# EAGLE schematic SOC_mcu_v2 (EAGLE 6.2)

## Sheet 1 of 4: Alimentación
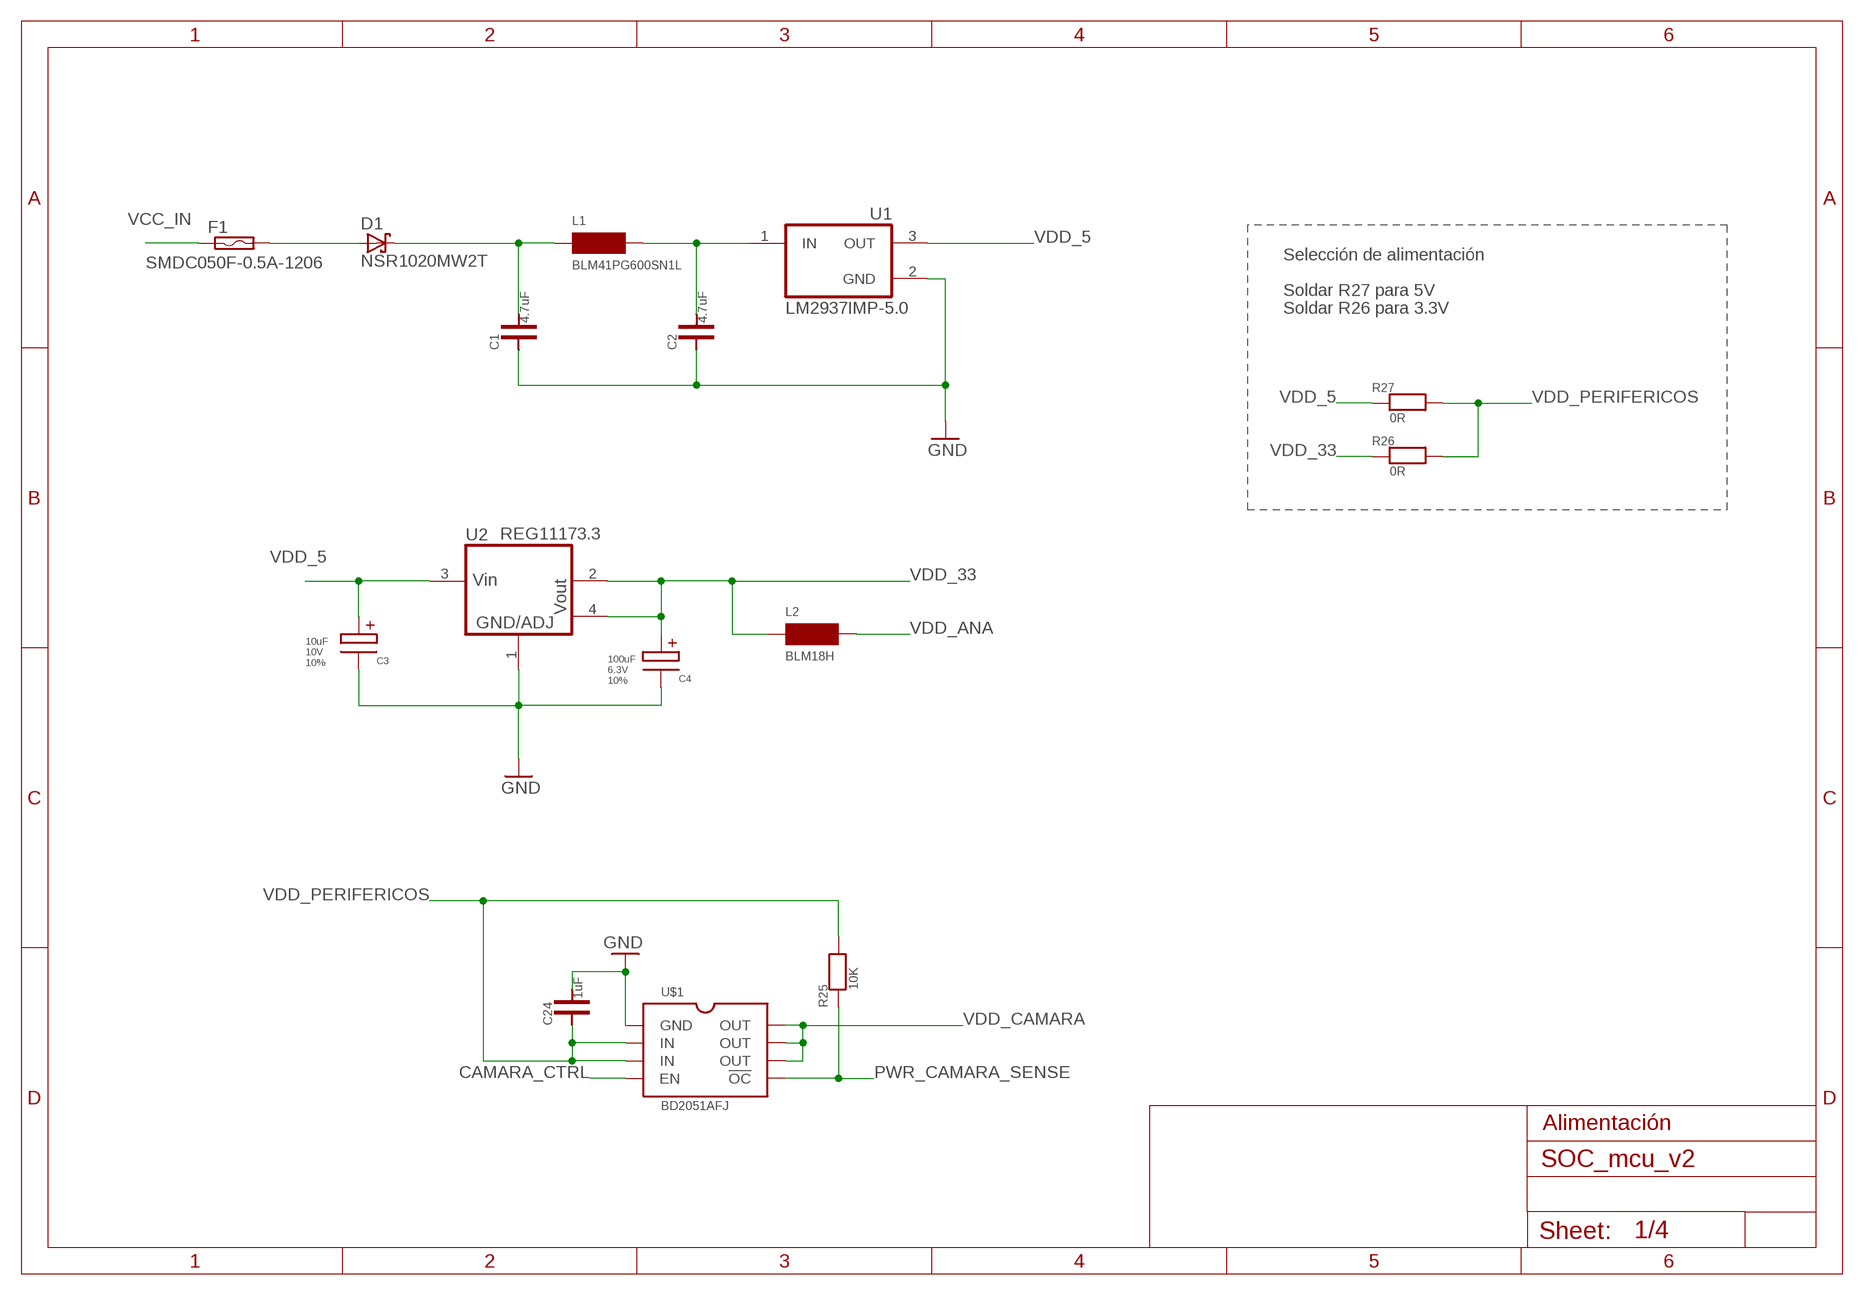
[diagram p0: schematic, sheet 1]

### Parts
C1  4.7uF  C_TF-4U7-16V-0805  [C0805]
C2  4.7uF  C_TF-4U7-16V-0805  [C0805]
C3  10uF  C293D10U-10V-10%-B  [3528-21]
C4  100uF  C293D100U-6V3-10%-B  [3528-21]
C24  1uF  C_TF-1U-6.3V-0402  [C0402]
D1  NSR1020MW2T  [SOD323]
F1  SMDC050F-0.5A-1206  [1206]
L1  BLM41PG600SN1L  [1806]
L2  BLM18H  [0603]
R25  10K  R_TF-10K-0.125W-1%-0402  [R0402]
R26  0R  R_TF-0R-0.0625W-0.05%-0402  [R0402]
R27  0R  R_TF-0R-0.0625W-0.05%-0402  [R0402]
U1  LM2937IMP-5.0  [SOT223]
U2  REG11173.3  [SOT223]
U$1  BD2051AFJ  [SO08]

### Nets
CAMARA_CTRL: U$1.4(EN) ; also sheet 2
GND: C1.1 C2.1 C3.NEG C4.NEG C24.2 U1.2(GND) U2.1(GND) U$1.1(GND) ; also sheet 2,3,4
N$1: C2.2 L1.P$2 U1.1(IN)
N$2: C1.2 D1.C L1.P$1
N$3: D1.A F1.2
PWR_CAMARA_SENSE: R25.1 U$1.5(!OC) ; also sheet 2
VCC_IN: F1.1 ; also sheet 4
VDD_5: C3.POS R27.1 U1.3(OUT) U2.3(VIN)
VDD_33: C4.POS L2.1 R26.1 U2.2(VOUT) U2.4(VO2) ; also sheet 2,3,4
VDD_ANA: L2.2 ; also sheet 2
VDD_CAMARA: U$1.6(OUT) U$1.7(OUT) U$1.8(OUT) ; also sheet 4
VDD_PERIFERICOS: C24.1 R25.2 R26.2 R27.2 U$1.2(IN) U$1.3(IN) ; also sheet 3

### Notes on the sheet
- Selección de alimentación
- Soldar R27 para 5V
- Soldar R26 para 3.3V
- Alimentación

## Sheet 2 of 4: Microprocesador
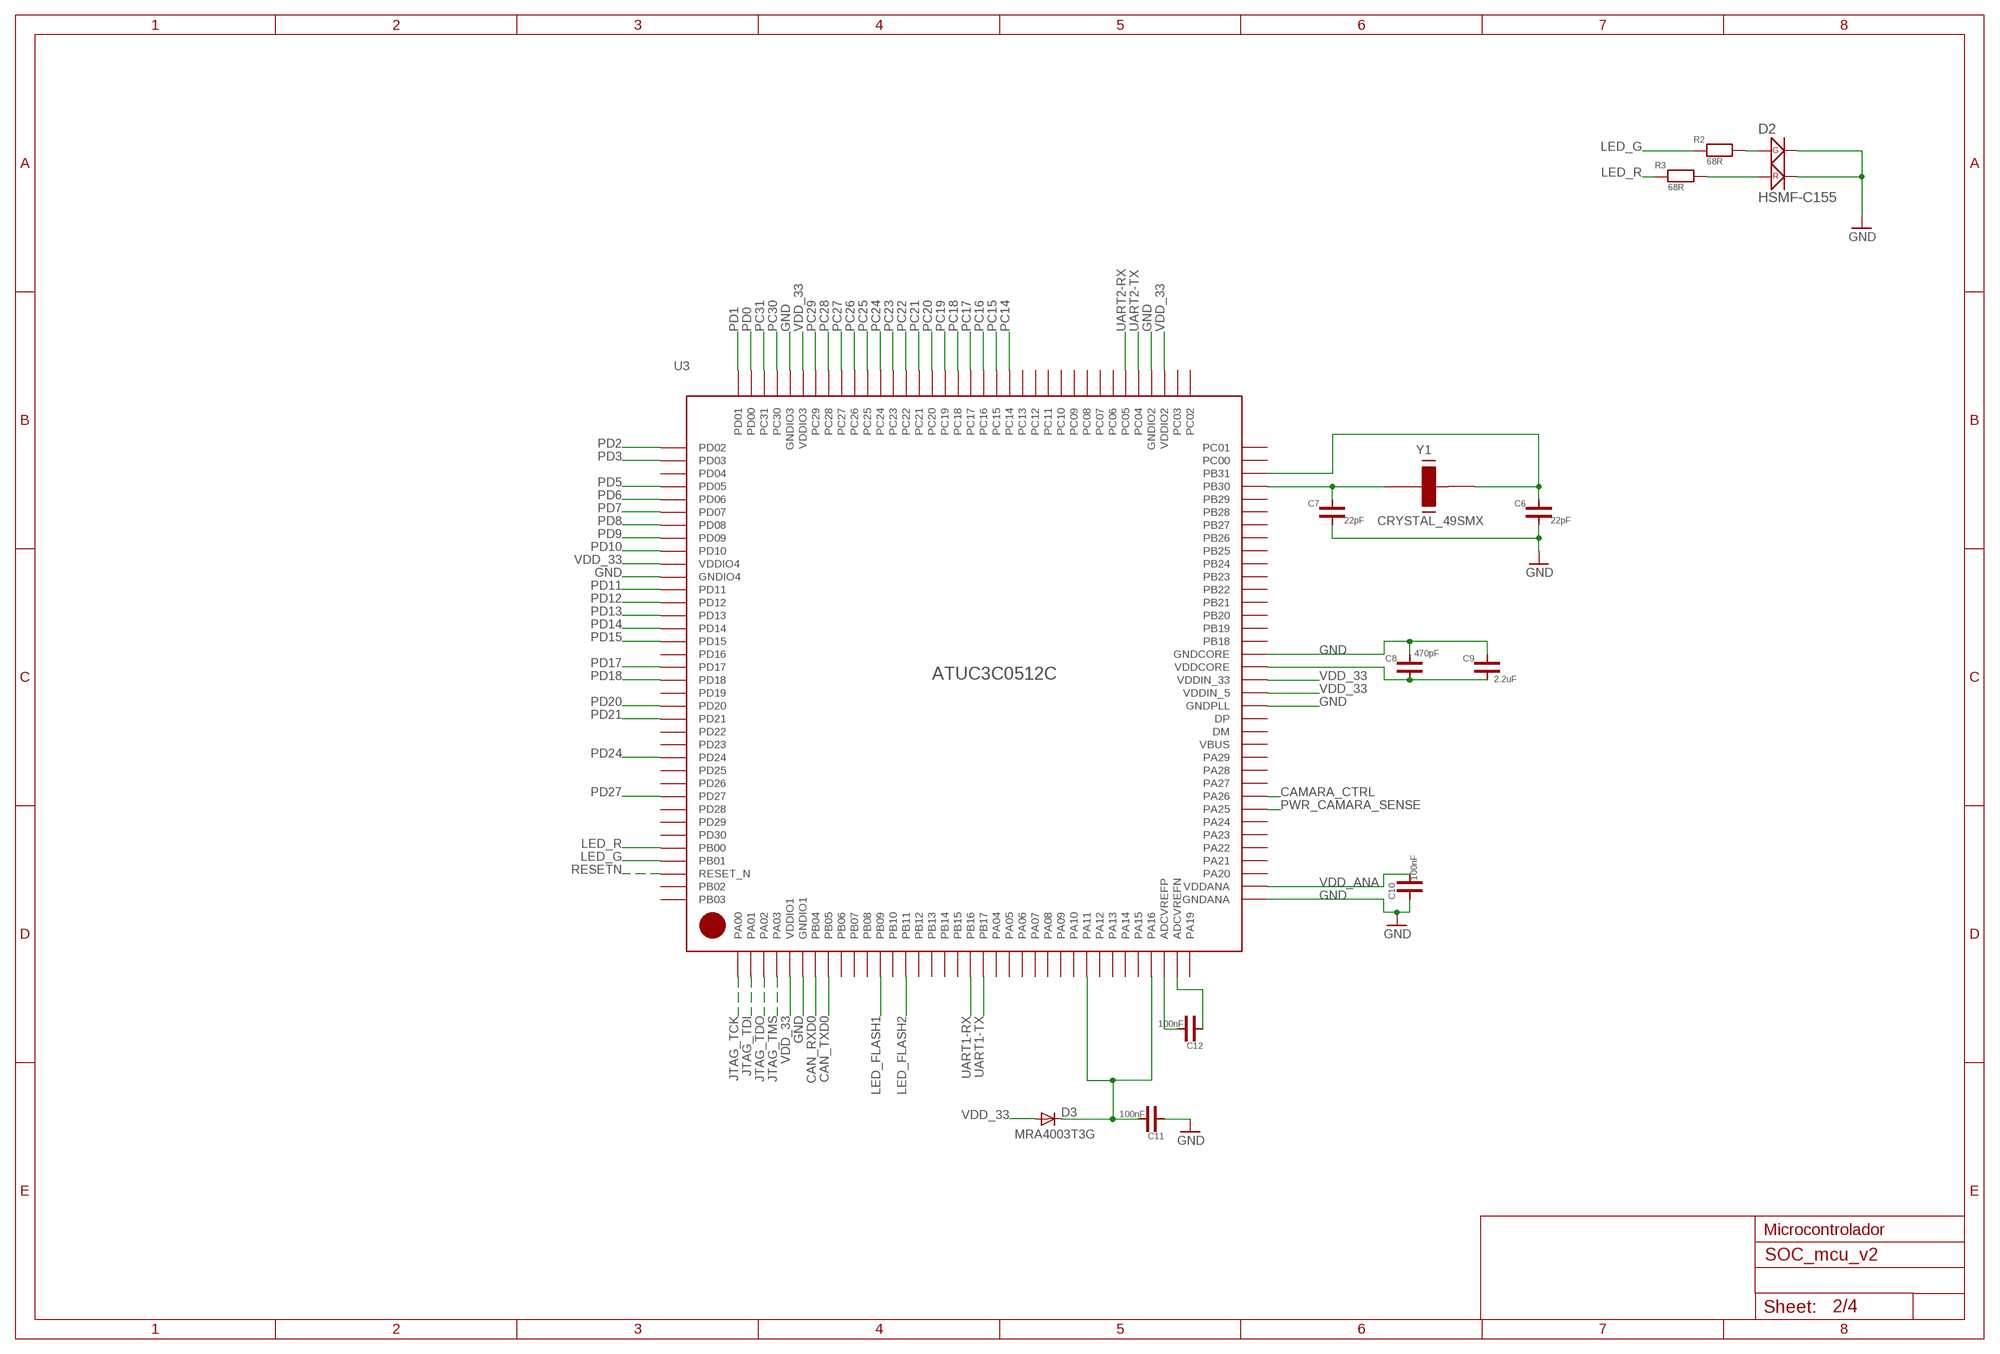
[diagram p1: schematic, sheet 2]

### Parts
C6  22pF  C_TF-22P-50V-0402  [C0402]
C7  22pF  C_TF-22P-50V-0402  [C0402]
C8  470pF  C_TF-470P-50V-0402  [C0402]
C9  2.2uF  C_TF-2U2-16V-0603  [C0603]
C10  100nF  C_TF-100N-25V-0402  [C0402]
C11  100nF  C_TF-100N-25V-0402  [C0402]
C12  100nF  C_TF-100N-25V-0402  [C0402]
D2  HSMF-C155  [HSMF-C]
D3  MRA4003T3G  [SMA]
R2  68R  R_TF-68R-0.063W-5%-0402  [R0402]
R3  68R  R_TF-68R-0.063W-5%-0402  [R0402]
U3  ATUC3C0512C  [TQFP144]
Y1  CRYSTAL_49SMX  [HC49UP]

### Nets
CAMARA_CTRL: U3.45(PA26) ; also sheet 1
CAN_RXD0: U3.7(PB04) ; also sheet 3
CAN_TXD0: U3.8(PB05) ; also sheet 3
GND: C6.1 C7.1 C8.2 C9.2 C10.1 C11.1 D2.2 D2.4 U3.6(GNDIO1) U3.37(GNDANA) U3.52(GNDPLL) U3.56(GNDCORE) U3.76(GNDIO2) U3.104(GNDIO3) U3.119(GNDIO4) ; also sheet 1,3,4
JTAG_TCK: U3.1(PA00) ; also sheet 4
JTAG_TDI: U3.2(PA01) ; also sheet 4
JTAG_TDO: U3.3(PA02) ; also sheet 4
JTAG_TMS: U3.4(PA03) ; also sheet 4
LED_FLASH1: U3.12(PB09) ; also sheet 4
LED_FLASH2: U3.14(PB11) ; also sheet 4
LED_G: R2.1 U3.141(PB01)
LED_R: R3.1 U3.140(PB00)
N$4: C6.2 U3.70(PB31) Y1.2
N$5: C7.2 U3.69(PB30) Y1.1
N$6: C8.1 C9.1 U3.55(VDDCORE)
N$7: D2.1 R2.2
N$8: D2.3 R3.2
N$10: C11.2 D3.C U3.28(PA11) U3.33(PA16)
N$11: C12.2 U3.34(ADCVREFP)
N$12: C12.1 U3.35(ADCVREFN)
PC14: U3.87(PC14) ; also sheet 3
PC15: U3.88(PC15) ; also sheet 3
PC16: U3.89(PC16) ; also sheet 3
PC17: U3.90(PC17) ; also sheet 3
PC18: U3.91(PC18) ; also sheet 3
PC19: U3.92(PC19) ; also sheet 3
PC20: U3.93(PC20) ; also sheet 3
PC21: U3.94(PC21) ; also sheet 3
PC22: U3.95(PC22) ; also sheet 3
PC23: U3.96(PC23) ; also sheet 3
PC24: U3.97(PC24) ; also sheet 3
PC25: U3.98(PC25) ; also sheet 3
PC26: U3.99(PC26) ; also sheet 3
PC27: U3.100(PC27) ; also sheet 3
PC28: U3.101(PC28) ; also sheet 3
PC29: U3.102(PC29) ; also sheet 3
PC30: U3.105(PC30) ; also sheet 3
PC31: U3.106(PC31) ; also sheet 3
PD0: U3.107(PD00) ; also sheet 3
PD1: U3.108(PD01) ; also sheet 3
PD2: U3.109(PD02) ; also sheet 3
PD3: U3.110(PD03) ; also sheet 3
PD5: U3.112(PD05) ; also sheet 3
PD6: U3.113(PD06) ; also sheet 3
PD7: U3.114(PD07) ; also sheet 3
PD8: U3.115(PD08) ; also sheet 3
PD9: U3.116(PD09) ; also sheet 3
PD10: U3.117(PD10) ; also sheet 3
PD11: U3.120(PD11) ; also sheet 3
PD12: U3.121(PD12) ; also sheet 3
PD13: U3.122(PD13) ; also sheet 3
PD14: U3.123(PD14) ; also sheet 3
PD15: U3.124(PD15) ; also sheet 3
PD17: U3.126(PD17) ; also sheet 3
PD18: U3.127(PD18) ; also sheet 3
PD20: U3.129(PD20) ; also sheet 3
PD21: U3.130(PD21) ; also sheet 3
PD24: U3.133(PD24) ; also sheet 3
PD27: U3.136(PD27) ; also sheet 3
PWR_CAMARA_SENSE: U3.44(PA25) ; also sheet 1
RESETN: U3.142(RESET_N) ; also sheet 4
UART1-RX: U3.19(PB16) ; also sheet 3
UART1-TX: U3.20(PB17) ; also sheet 3
UART2-RX: U3.78(PC05) ; also sheet 3
UART2-TX: U3.77(PC04) ; also sheet 3
VDD_33: D3.A U3.5(VDDIO1) U3.53(VDDIN_5) U3.54(VDDIN_33) U3.75(VDDIO2) U3.103(VDDIO3) U3.118(VDDIO4) ; also sheet 1,3,4
VDD_ANA: C10.2 U3.38(VDDANA) ; also sheet 1
Unconnected: U3.9(PB06) U3.10(PB07) U3.11(PB08) U3.13(PB10) U3.15(PB12) U3.16(PB13) U3.17(PB14) U3.18(PB15) U3.21(PA04) U3.22(PA05) U3.23(PA06) U3.24(PA07) U3.25(PA08) U3.26(PA09) U3.27(PA10) U3.29(PA12) U3.30(PA13) U3.31(PA14) U3.32(PA15) U3.36(PA19) U3.39(PA20) U3.40(PA21) U3.41(PA22) U3.42(PA23) U3.43(PA24) U3.46(PA27) U3.47(PA28) U3.48(PA29) U3.49(VBUS) U3.50(DM) U3.51(DP) U3.57(PB18) U3.58(PB19) U3.59(PB20) U3.60(PB21) U3.61(PB22) U3.62(PB23) U3.63(PB24) U3.64(PB25) U3.65(PB26) U3.66(PB27) U3.67(PB28) U3.68(PB29) U3.71(PC00) U3.72(PC01) U3.73(PC02) U3.74(PC03) U3.79(PC06) U3.80(PC07) U3.81(PC08) U3.82(PC09) U3.83(PC10) U3.84(PC11) U3.85(PC12) U3.86(PC13) U3.111(PD04) U3.125(PD16) U3.128(PD19) U3.131(PD22) U3.132(PD23) U3.134(PD25) U3.135(PD26) U3.137(PD28) U3.138(PD29) U3.139(PD30) U3.143(PB02) U3.144(PB03)

### Notes on the sheet
- Microcontrolador

## Sheet 3 of 4: Perifericos
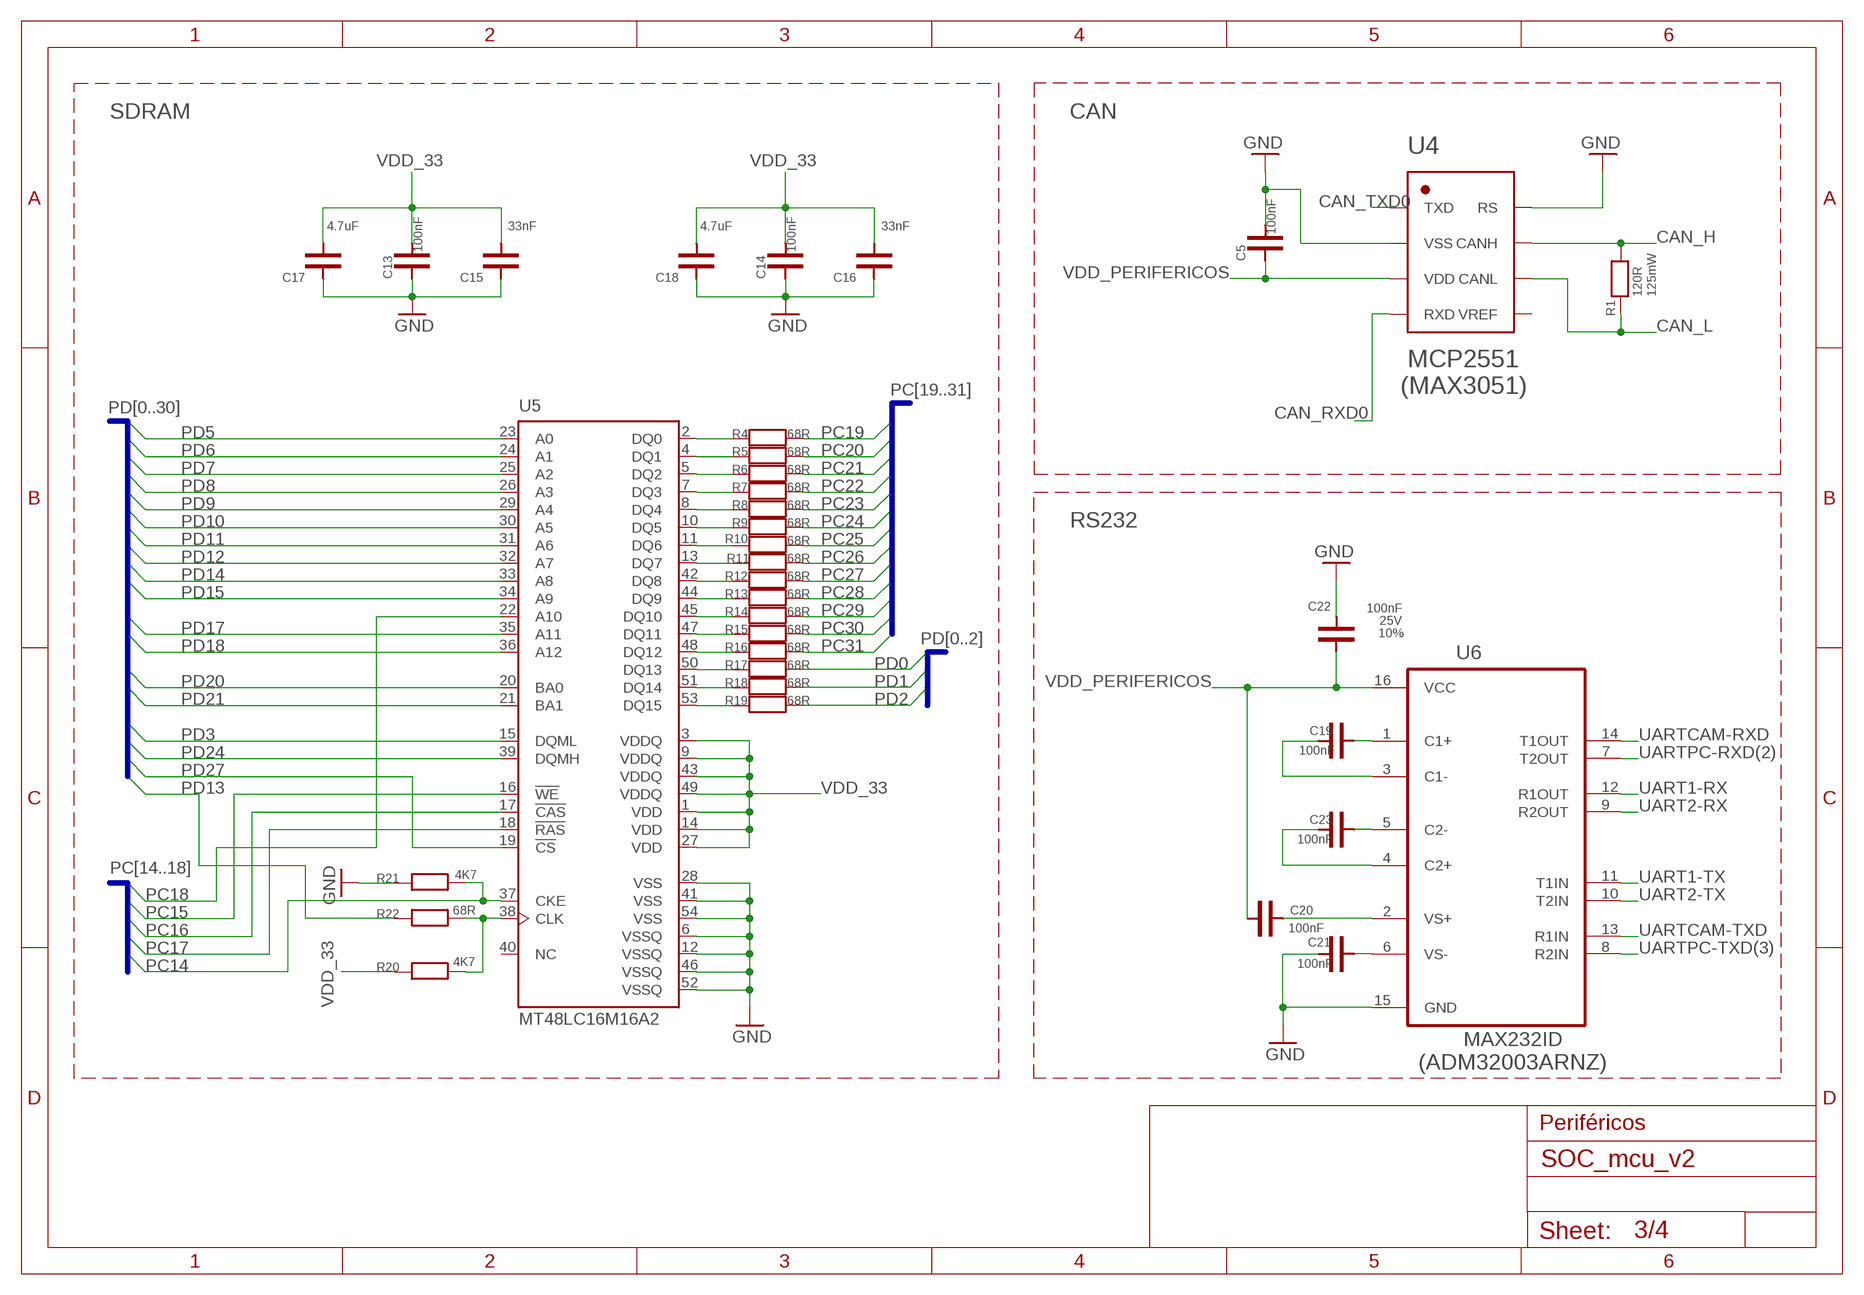
[diagram p2: schematic, sheet 3]

### Parts
C5  100nF  C_TF-100N-25V-0402  [C0402]
C13  100nF  C_TF-100N-25V-0402  [C0402]
C14  100nF  C_TF-100N-25V-0402  [C0402]
C15  33nF  C_TF-33N-25V-0402  [C0402]
C16  33nF  C_TF-33N-25V-0402  [C0402]
C17  4.7uF  C_TF-4U7-16V-0805  [C0805]
C18  4.7uF  C_TF-4U7-16V-0805  [C0805]
C19  100nF  C_TF-100N-25V-0402  [C0402]
C20  100nF  C_TF-100N-25V-0402  [C0402]
C21  100nF  C_TF-100N-25V-0402  [C0402]
C22  100nF  C_TF-100N-25V-0402  [C0402]
C23  100nF  C_TF-100N-25V-0402  [C0402]
R1  120R  R_TF-120R-0.125W-1%-0402  [R0402]
R4  68R  R_TF-68R-0.063W-5%-0402  [R0402]
R5  68R  R_TF-68R-0.063W-5%-0402  [R0402]
R6  68R  R_TF-68R-0.063W-5%-0402  [R0402]
R7  68R  R_TF-68R-0.063W-5%-0402  [R0402]
R8  68R  R_TF-68R-0.063W-5%-0402  [R0402]
R9  68R  R_TF-68R-0.063W-5%-0402  [R0402]
R10  68R  R_TF-68R-0.063W-5%-0402  [R0402]
R11  68R  R_TF-68R-0.063W-5%-0402  [R0402]
R12  68R  R_TF-68R-0.063W-5%-0402  [R0402]
R13  68R  R_TF-68R-0.063W-5%-0402  [R0402]
R14  68R  R_TF-68R-0.063W-5%-0402  [R0402]
R15  68R  R_TF-68R-0.063W-5%-0402  [R0402]
R16  68R  R_TF-68R-0.063W-5%-0402  [R0402]
R17  68R  R_TF-68R-0.063W-5%-0402  [R0402]
R18  68R  R_TF-68R-0.063W-5%-0402  [R0402]
R19  68R  R_TF-68R-0.063W-5%-0402  [R0402]
R20  4K7  R_TF-4K7-0.125W-1%-0402  [R0402]
R21  4K7  R_TF-4K7-0.125W-1%-0402  [R0402]
R22  68R  R_TF-68R-0.063W-5%-0402  [R0402]
U4  MCP2551  [SO08]
U5  MT48LC16M16A2  [TSOP54-400]
U6  MAX232ID  [SOIC127P600X175-16N]

### Nets
CAN_H: R1.2 U4.7(CANH) ; also sheet 4
CAN_L: R1.1 U4.6(CANL) ; also sheet 4
CAN_RXD0: U4.4(RXD) ; also sheet 2
CAN_TXD0: U4.1(TXD) ; also sheet 2
GND: C5.2 C13.1 C14.1 C15.1 C16.1 C17.1 C18.1 C21.1 C22.2 R21.1 U4.2(VSS) U4.8(RS) U5.6(VSSQ) U5.12(VSSQ) U5.28(VSS) U5.41(VSS) U5.46(VSSQ) U5.52(VSSQ) U5.54(VSS) U6.15(GND) ; also sheet 1,2,4
N$9: R4.1 U5.2(DQ0)
N$13: R5.1 U5.4(DQ1)
N$14: R6.1 U5.5(DQ2)
N$15: R7.1 U5.7(DQ3)
N$16: R8.1 U5.8(DQ4)
N$17: R9.1 U5.10(DQ5)
N$18: C19.2 U6.1(C1+)
N$19: R10.1 U5.11(DQ6)
N$20: R11.1 U5.13(DQ7)
N$21: R12.1 U5.42(DQ8)
N$22: R13.1 U5.44(DQ9)
N$23: R14.1 U5.45(DQ10)
N$24: R15.1 U5.47(DQ11)
N$25: R16.1 U5.48(DQ12)
N$26: R17.1 U5.50(DQ13)
N$27: R18.1 U5.51(DQ14)
N$28: R19.1 U5.53(DQ15)
N$30: R20.2 R22.2 U5.38(CLK)
N$32: C23.2 U6.5(C2-)
N$33: C19.1 U6.3(C1-)
N$34: C20.2 U6.2(VS+)
N$35: C23.1 U6.4(C2+)
N$37: C21.2 U6.6(VS-)
PC14: R21.2 U5.37(CKE) ; also sheet 2
PC15: U5.16(!WE) ; also sheet 2
PC16: U5.17(!CAS) ; also sheet 2
PC17: U5.18(!RAS) ; also sheet 2
PC18: U5.22(A10) ; also sheet 2
PC19: R4.2 ; also sheet 2
PC20: R5.2 ; also sheet 2
PC21: R6.2 ; also sheet 2
PC22: R7.2 ; also sheet 2
PC23: R8.2 ; also sheet 2
PC24: R9.2 ; also sheet 2
PC25: R10.2 ; also sheet 2
PC26: R11.2 ; also sheet 2
PC27: R12.2 ; also sheet 2
PC28: R13.2 ; also sheet 2
PC29: R14.2 ; also sheet 2
PC30: R15.2 ; also sheet 2
PC31: R16.2 ; also sheet 2
PD0: R17.2 ; also sheet 2
PD1: R18.2 ; also sheet 2
PD2: R19.2 ; also sheet 2
PD3: U5.15(DQML) ; also sheet 2
PD5: U5.23(A0) ; also sheet 2
PD6: U5.24(A1) ; also sheet 2
PD7: U5.25(A2) ; also sheet 2
PD8: U5.26(A3) ; also sheet 2
PD9: U5.29(A4) ; also sheet 2
PD10: U5.30(A5) ; also sheet 2
PD11: U5.31(A6) ; also sheet 2
PD12: U5.32(A7) ; also sheet 2
PD13: R22.1 ; also sheet 2
PD14: U5.33(A8) ; also sheet 2
PD15: U5.34(A9) ; also sheet 2
PD17: U5.35(A11) ; also sheet 2
PD18: U5.36(A12) ; also sheet 2
PD20: U5.20(BA0) ; also sheet 2
PD21: U5.21(BA1) ; also sheet 2
PD24: U5.39(DQMH) ; also sheet 2
PD27: U5.19(!CS) ; also sheet 2
UART1-RX: U6.12(R1OUT) ; also sheet 2
UART1-TX: U6.11(T1IN) ; also sheet 2
UART2-RX: U6.9(R2OUT) ; also sheet 2
UART2-TX: U6.10(T2IN) ; also sheet 2
UARTCAM-RXD: U6.14(T1OUT) ; also sheet 4
UARTCAM-TXD: U6.13(R1IN) ; also sheet 4
UARTPC-RXD(2): U6.7(T2OUT) ; also sheet 4
UARTPC-TXD(3): U6.8(R2IN) ; also sheet 4
VDD_33: C13.2 C14.2 C15.2 C16.2 C17.2 C18.2 R20.1 U5.1(VDD) U5.3(VDDQ) U5.9(VDDQ) U5.14(VDD) U5.27(VDD) U5.43(VDDQ) U5.49(VDDQ) ; also sheet 1,2,4
VDD_PERIFERICOS: C5.1 C20.1 C22.1 U4.3(VDD) U6.16(VCC) ; also sheet 1
Unconnected: U4.5(VREF) U5.40(NC)

### Buses
PC[19..31]
PC[14..18]
PD[0..30]
PD[0..2]

### Notes on the sheet
- SDRAM | CAN
- (MAX3051)
- RS232
- (ADM32003ARNZ)
- Periféricos

## Sheet 4 of 4: Conectores
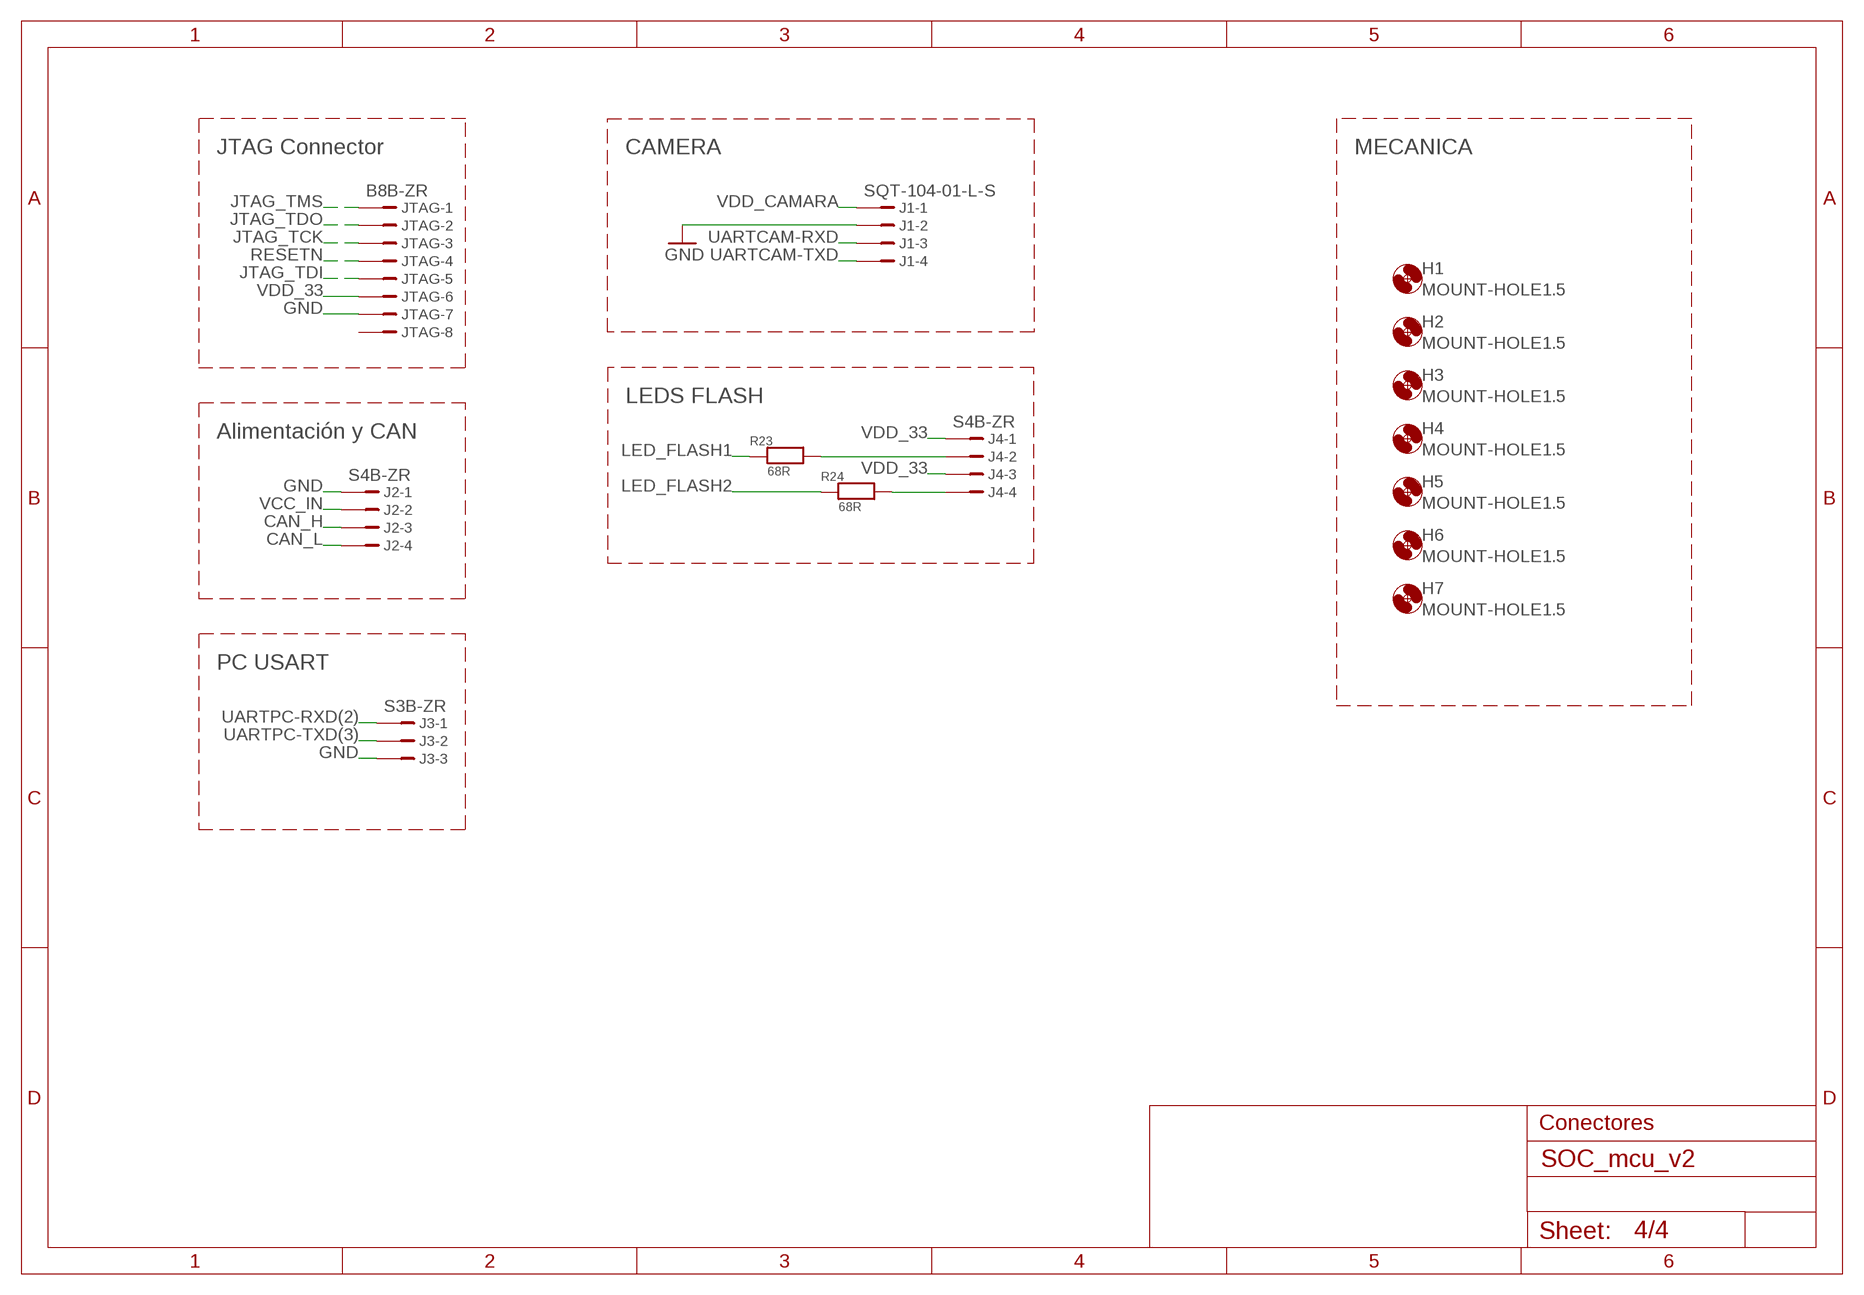
[diagram p3: schematic, sheet 4]

### Parts
H1  MOUNT-HOLE1.5  [1,5]
H2  MOUNT-HOLE1.5  [1,5]
H3  MOUNT-HOLE1.5  [1,5]
H4  MOUNT-HOLE1.5  [1,5]
H5  MOUNT-HOLE1.5  [1,5]
H6  MOUNT-HOLE1.5  [1,5]
H7  MOUNT-HOLE1.5  [1,5]
J1  SQT-104-01-L-S  [THD-SQT-104-01-L-S]
J2  S4B-ZR  [S4B-ZR]
J3  S3B-ZR  [S3B-ZR]
J4  S4B-ZR  [S4B-ZR]
JTAG  B8B-ZR  [B8B-ZR]
R23  68R  R_TF-68R-0.063W-5%-0402  [R0402]
R24  68R  R_TF-68R-0.063W-5%-0402  [R0402]

### Nets
CAN_H: J2.3 ; also sheet 3
CAN_L: J2.4 ; also sheet 3
GND: J1.2 J2.1 J3.3 JTAG.7 ; also sheet 1,2,3
JTAG_TCK: JTAG.3 ; also sheet 2
JTAG_TDI: JTAG.5 ; also sheet 2
JTAG_TDO: JTAG.2 ; also sheet 2
JTAG_TMS: JTAG.1 ; also sheet 2
LED_FLASH1: R23.1 ; also sheet 2
LED_FLASH2: R24.1 ; also sheet 2
N$38: J4.2 R23.2
N$39: J4.4 R24.2
RESETN: JTAG.4 ; also sheet 2
UARTCAM-RXD: J1.3 ; also sheet 3
UARTCAM-TXD: J1.4 ; also sheet 3
UARTPC-RXD(2): J3.1 ; also sheet 3
UARTPC-TXD(3): J3.2 ; also sheet 3
VCC_IN: J2.2 ; also sheet 1
VDD_33: J4.1 J4.3 JTAG.6 ; also sheet 1,2,3
VDD_CAMARA: J1.1 ; also sheet 1
Unconnected: JTAG.8

### Notes on the sheet
- JTAG Connector | CAMERA | MECANICA
- LEDS FLASH
- Alimentación y CAN
- PC USART
- Conectores

## Power pins joined to a net without a drawn wire
GND: U1.4(GND)

## Library data of the parts
C1 C2 C17 C18 = tf_condensador:C_TF-; OC_FARNELL: 1845746; TOLERANCE: 10%; VOLTAGE: 16V
C3 = tf_condensador_polarizado:C293D: Condensador; MPN: 293D106X9010B2TE3; OC_FARNELL: 175-4163; OC_RS: 684-3888; TOLERANCE: 10%; VOLTAGE: 10V
C4 = tf_condensador_polarizado:C293D: Condensador; MPN: 293D107X96R3B2TE3; OC_FARNELL: 175-4153; OC_RS: 684-3932; TOLERANCE: 10%; VOLTAGE: 6.3V
C5 C10-C14 C19-C23 = tf_condensador:C_TF-; OC_FARNELL: 1867948; OC_RS: 723-5174; TOLERANCE: 10%; VOLTAGE: 25V
C6 C7 = tf_condensador:C_TF-; OC_FARNELL: 8819629; OC_RS: 624-2187; TOLERANCE: 5%; VOLTAGE: 50V
C8 = tf_condensador:C_TF-; OC_FARNELL: 1414593; OC_RS: -; TOLERANCE: 10%; VOLTAGE: 50V
C9 = tf_condensador:C_TF-; OC_FARNELL: 1458901; OC_RS: -; TOLERANCE: 80%; VOLTAGE: 16V
C15 C16 = tf_condensador:C_TF-; OC_FARNELL: 1865445; OC_RS: -; TOLERANCE: 10%; VOLTAGE: 25V
C24 = tf_condensador:C_TF-; OC_FARNELL: 1845729; OC_RS: 723-5180; TOLERANCE: 10%; VOLTAGE: 6.3V
D1 = tf_diode:NSR1020MW2T: Diodo Schottky Datasheet <http://www.onsemi.com/pub_link/Collateral/NSR1020MW2T1-D.PDF> Forward Current: 1A Forward Voltage: 440mV Package: SOD-323; MPN: NSR1020MW2T1G; OC_FARNELL: 1431027; OC_RS: -
D2 = tf_led:HSMF-C155: Led bicolor Rojo y Verde Datasheet <http://www.avagotech.com/docs/AV02-0427EN> Forward current: 20mA Forward voltage: 2.1V@20mA; MPN: HSMF-C155; OC_FARNELL: 579-0888; OC_RS: 486-0430
D3 = tf_diode:MRA4003T3G: MRA4003T3G Standard Recovery Power Rectifier datasheet <http://www.farnell.com/datasheets/1639171.pdf>; MPN: MRA4003T3G; OC_FARNELL: 1459134; OC_RS: 545-2434
F1 = tf_fusibles:SMDC050F-*: PolySwitch (TM) Resettable Device Source: Data sheet <http://www.farnell.com/datasheets/68397.pdf>; MPN: NANOSMDC050F/13.2; OC_FARNELL: 134-5942; OC_RS: 138-679
H1-H7 = tf_holes:MOUNT-HOLE: MOUNTING HOLE with drill center marker
J1 = tf_conectores_thd:SQT-104-01-L-S; MPN: SQT-104-01-L-S; OC_FARNELL: 1668155
J2 J4 = tf_conectores_thd:S4B-ZR; MPN: S4B-ZR; OC_FARNELL: 9491830
J3 = tf_conectores_thd:S3B-ZR: S3B-ZR JST connector 3way Datasheet <http://www.farnell.com/datasheets/80556.pdf>; MPN: S3B-ZR; OC_FARNELL: 9491821; OC_RS: -
JTAG = tf_conectores_thd:B8B-ZR: B8B-ZR JST connector 8 way vertical 1.5mm pitch spacing Datasheet <http://www.farnell.com/datasheets/621906.pdf>; MPN: B8B-ZR; OC_FARNELL: 1830904; OC_RS: -
L1 = tf_ferritas:BLM41PG600SN1L: Ferrita BLM41PG600SN1L Chip Ferrite Bead datasheet <http://search.murata.co.jp/Ceramy/image/img/PDF/ENG/L0110S0100BLM41P.pdf>; OC_FARNELL: 9526900; OC_RS: 188-8665
L2 = tf_ferritas:BLM18H: Ferrita Fabricante: Murata Package: 0603 Resistencia DC: 1ohm Corriente DC:200mA; MPN: BLM18HG601SN1D; OC_FARNELL: 1515733; OC_RS: 724-1378
R1 = tf_resistencia_smd:R_TF-: Resistor; OC_FARNELL: 1738838; OC_RS: -; POWER: 125mW; TOLERANCE: 1%
R2-R19 R22-R24 = tf_resistencia_smd:R_TF-: Resistor; OC_FARNELL: 1739078; OC_RS: 678-9535; POWER: 63mW; TOLERANCE: 5%
R20 R21 = tf_resistencia_smd:R_TF-: Resistor; OC_FARNELL: 1738858; OC_RS: -; POWER: 125mW; TOLERANCE: 1%
R25 = tf_resistencia_smd:R_TF-: Resistor; OC_FARNELL: 1738864; OC_RS: 678-4697; POWER: 125mW; TOLERANCE: 1%
R26 R27 = tf_resistencia_smd:R_TF-: Resistor; OC_FARNELL: 2073956; POWER: 62.5mW; TOLERANCE: 0.05%
U1 = tf_conversores_DC_DC:LM2937IMP-*: 400 and 500 mA Low Dropout Voltage Regulator NATIONAL SEMICONDUCTOR created by Peter.Hofmann@ph-tronic.de <mailto:Reter.Hofmann@ph-tronic.de> 10-2004 Rev.0 Datasheet <http://http://www.ti.com/lit/ds/symlink/lm2937.pdf>; MPN: LM2937IMP-5.0; OC_FARNELL: 1798318; OC_RS: 761-5609
U2 = tf_conversores_DC_DC:REG1117: 800mA and 1A Low Dropout (LDO) Positive Regulator 1.8V, 2.5V, 2.85V, 3.3V, 5V, and Adj; MPN: TLV1117-33CDCY; OC_FARNELL: 1494942; OC_RS: 660-7975
U3 = tf_atmel:ATUC3C0512C: ATUC3C0512C Datasheet <\\REPOSITORITF\volume1_public\ProyectosN\SOC_1202\Recursos compartidos\datasheets\Atmel\at32uc3c0512c.pdf> Application Notes <\\REPOSITORITF\volume1_public\ProyectosN\SOC_1202\Recursos compartidos\datasheets\Atmel\at32uc3c0512c-applications notes.pdf> AT32UC3C-EK Schematic <\\REPOSITORITF\volume1_public\ProyectosN\SOC_1202\Recursos compartidos\datasheets\Atmel\at32uc3c-ek-shcematicboard.pdf> Fabricante: Atmel AVR32 Microcontroller; MPN: AT32UC3C0512C-ALUT; OC_FARNELL: 1972028; OC_RS: 738-0120
U4 = tf_comunicaciones:MCP2551: CAN Transciever; MPN: MCP2551; OC_FARNELL: 1467746
U5 = tf_memorias:MT48LC16M16A2: 256Mb: x16 SDRAM MT48LC16M16A2 - 4 Meg x 16 x 4 banks Datasheet <http://download.micron.com/pdf/datasheets/dram/sdram/256MSDRAM.pdf>; MPN: MT48LC16M16A2P-7E:D; OC_FARNELL: 1216281
U6 = tf_comunicaciones:MAX232ID: DUAL EIA-232 DRIVERS/ RECEIVERS; MPN: MAX232ID; OC_FARNELL: 9589791; OC_NEWARK: 75C0974; PACKAGE: SOIC-16; SUPPLIER: Texas Instruments
U$1 = tf_drivers:BD2051AFJ: 1ch Hide Side Switch IC Single channel high side switch IC is a high side switch having over current protection used in power supply line. Datahseet <http://www.farnell.com/datasheets/1636635.pdf> Features Power supply voltage range: 2.7V~5.5V Continuous current load: 500mA Control input logic Active-High Over current detection Thermal shutdown Under voltage lockout; MPN: BD2051AFJ; OC_FARNELL: 2142991; OC_RS: -
Y1 = tf_xtal:CRYSTAL_49SMX: Crystal Fabricante: Euroquartz 16MHz; MPN: 16.000MHZ 49USMX/30/50/40/18PF/ATF; OC_FARNELL: 1640900